# EAGLE design split_node (EAGLE 7.7.0)
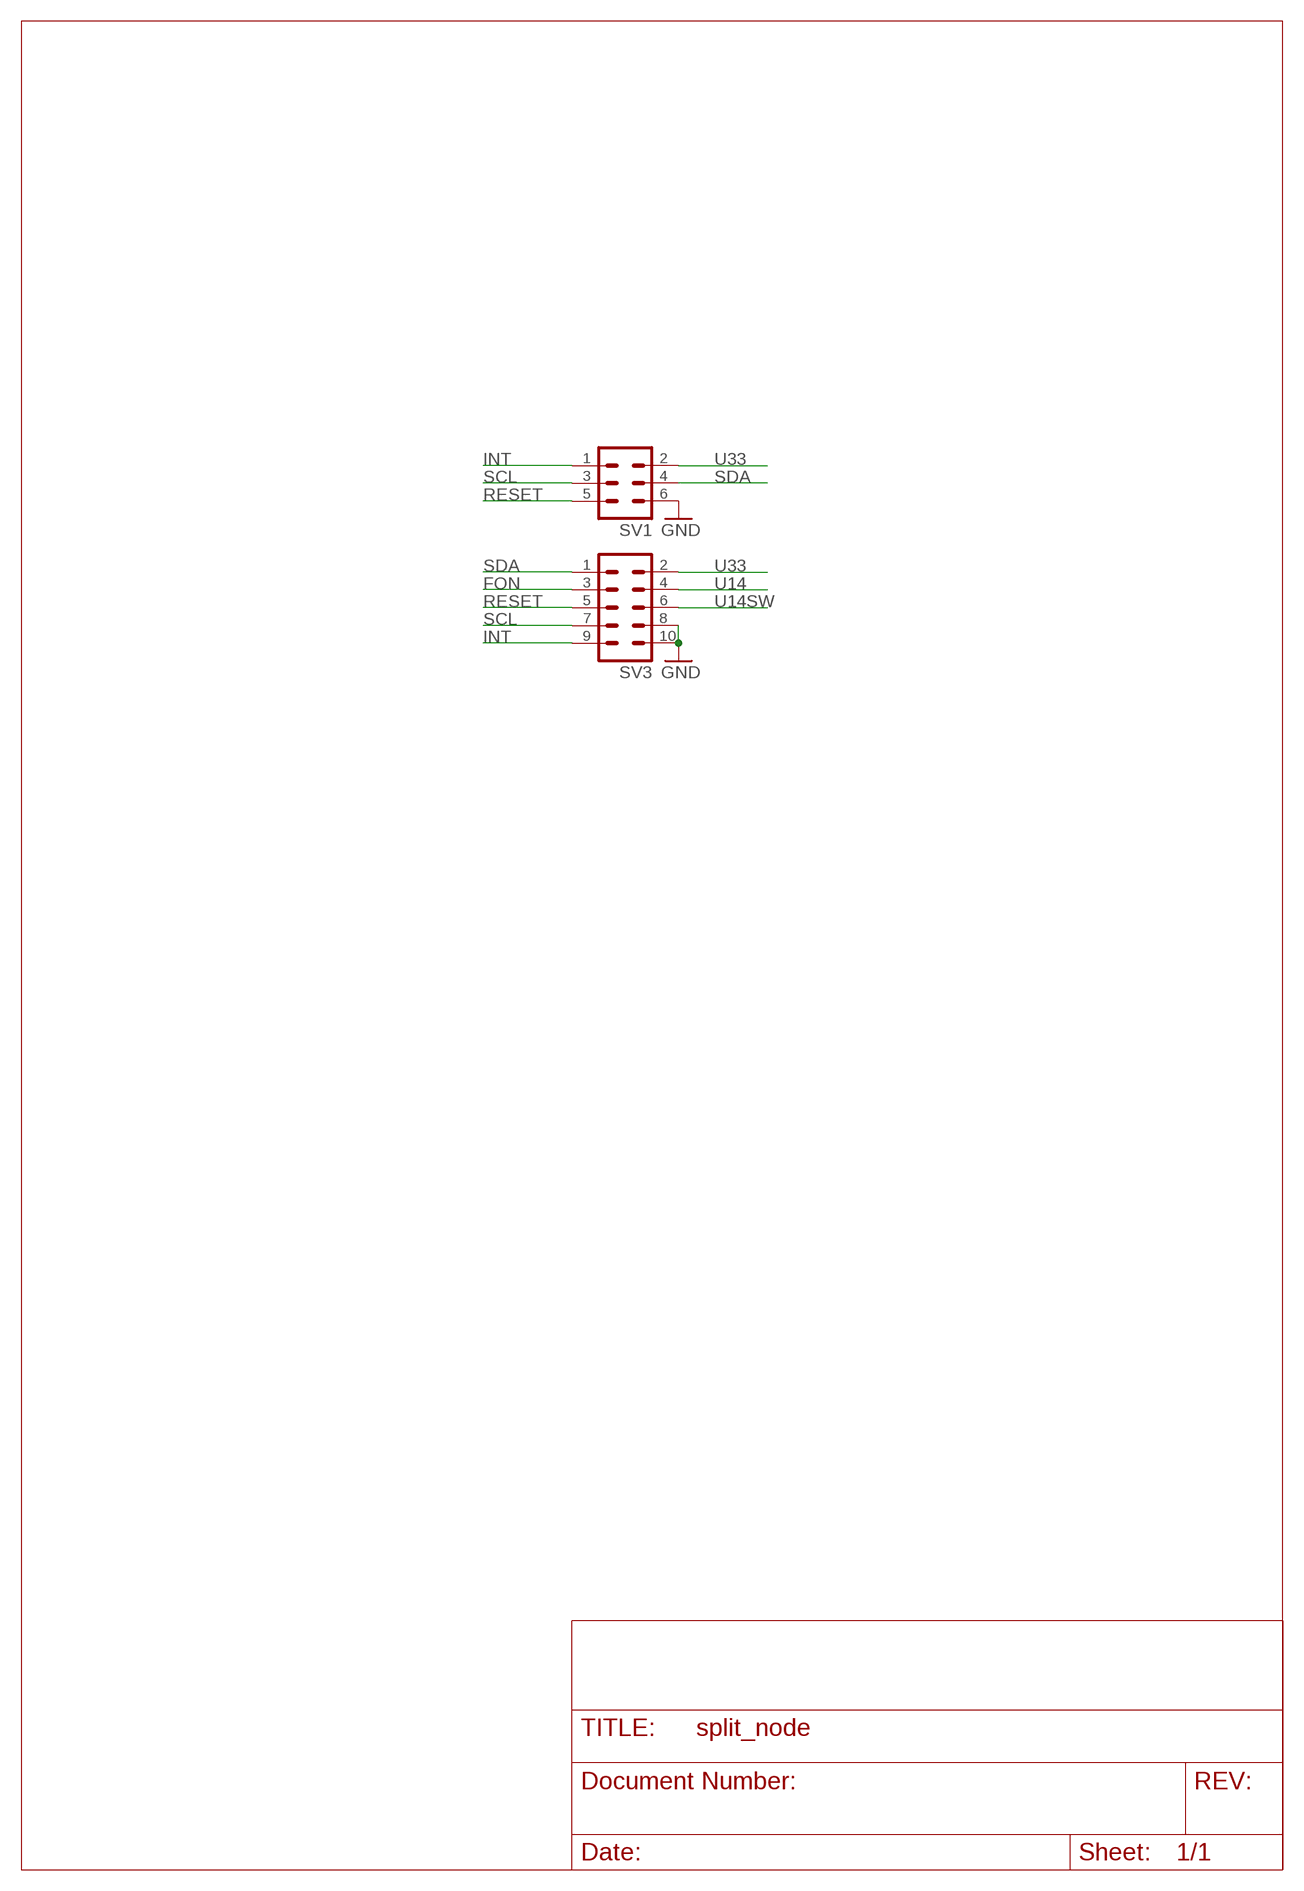
[diagram p0: schematic, sheet 1]

## Parts
SV1  ML6  [ML6]
SV3  ML10  [ML10]

## Nets
FON: SV3.3
GND: SV1.6 SV3.8 SV3.10
INT: SV1.1 SV3.9
RESET: SV1.5 SV3.5
SCL: SV1.3 SV3.7
SDA: SV1.4 SV3.1
U14: SV3.4
U14SW: SV3.6
U33: SV1.2 SV3.2

## Library data of the parts
SV1 = con-harting-ml:ML6: HARTING; OC_FARNELL: unknown; OC_NEWARK: unknown
SV3 = con-harting-ml:ML10: HARTING; OC_FARNELL: unknown; OC_NEWARK: unknown

## Board
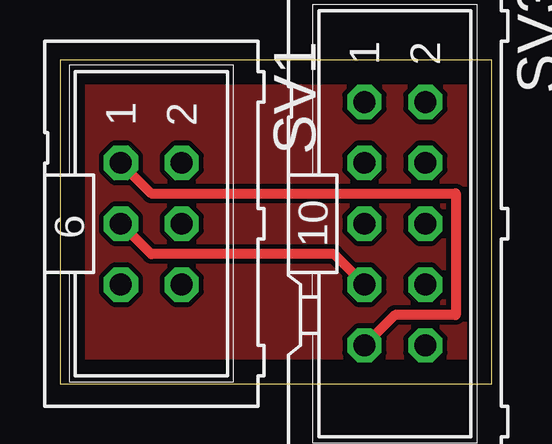
[diagram p1: board, top side]
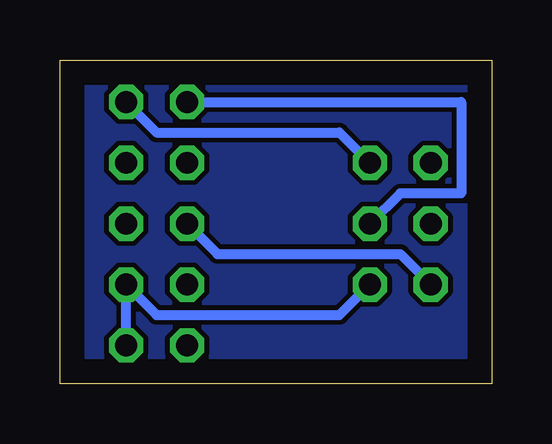
[diagram p2: board, bottom side, seen from below]

Size 18 x 13.5 mm. Coordinates in mm from the lower left corner, seen from the top.
Outline: 0,0 18,0 18,13.5 0,13.5 0,0
Copper layers (1*16): Top 0.035mm / dielectric 1.5mm / Bottom 0.035mm
Design rules "default": minimum track width 10mil, minimum drill 24mil, track to track 8mil, track to pad 8mil, pad to pad 8mil, via to via 8mil, smd to smd 8mil, copper to edge 40mil, drill to drill 8mil, minimum pad ring 10mil, minimum via ring 8mil, stop-mask expansion 4mil, vias tented up to drill 0mil, thermal gap 10mil

### Footprints (pad centres in the part's own frame; a part is rotated, then mirrored left to right if it is on the bottom)
ML6 = drill 0.914 octagon: 1 -2.54,-1.27; 2 -2.54,1.27; 3 0,-1.27; 4 0,1.27; 5 2.54,-1.27; 6 2.54,1.27
ML10 = drill 0.914 octagon: 1 -5.08,-1.27; 2 -5.08,1.27; 3 -2.54,-1.27; 4 -2.54,1.27; 5 0,-1.27; 6 0,1.27; 7 2.54,-1.27; 8 2.54,1.27; 9 5.08,-1.27; 10 5.08,1.27

### Placement (x,y rotation side)
SV1  3.81,6.67 270 top
SV3  13.97,6.67 270 top

### Tracks (layer width: path | path; a pad name or v marks a point on that pad's centre or on a via)
GND
  Bottom 0.406: SV3.10 SV3.8 13.97,2.86 6.35,2.86 SV1.6
GND1
  pour Bottom: 0,0 18,0 18,13.5 0,13.5
  pour Top: 0,0 18,0 18,13.5 0,13.5
INT
  Top 0.406: SV1.1 3.81,7.94 16.51,7.94 16.51,2.86 13.97,2.86 SV3.9
RESET
  Bottom 0.406: SV3.5 11.43,5.4 3.81,5.4 SV1.5
SCL
  Top 0.406: SV3.7 11.43,5.4 3.81,5.4 SV1.3
SDA
  Bottom 0.406: SV3.1 1.27,11.75 1.27,7.94 3.81,7.94 SV1.4
U33
  Bottom 0.406: SV3.2 13.97,10.48 6.35,10.48 SV1.2